# EAGLE design rc-driver-programmer (EAGLE 7.1.0)
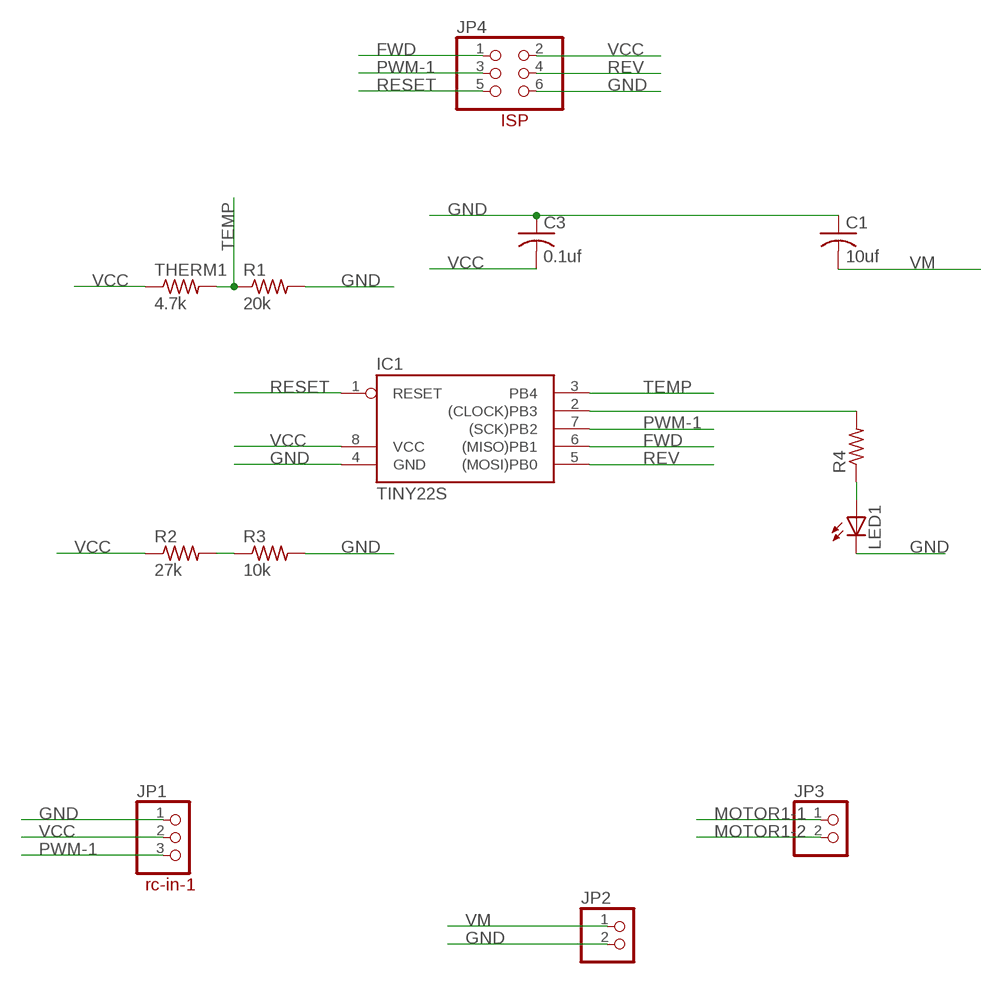
[diagram p0: schematic, sheet 1]

## Parts
C1  10uf  C-USC1210  [C1210]
C3  0.1uf  C-USC0805  [C0805]
IC1  TINY22S  [SOIC8]
JP1  PINHD-1X3  [1X03]
JP2  PINHD-1X2  [1X02]
JP3  PINHD-1X2  [1X02]
JP4  PINHD-2X3  [2X03]
LED1  LEDCHIP-LED0603  [CHIP-LED0603]
R1  20k  R-US_R0603  [R0603]
R2  27k  R-US_R0603  [R0603]
R3  10k  R-US_R0603  [R0603]
R4  R-US_R0603  [R0603]
THERM1  4.7k  R-US_R0603  [R0603]

## Nets
FWD: IC1.6((MISO)PB1) JP4.1
GND: C1.1 C3.1 IC1.4(GND) JP1.1 JP2.2 JP4.6 LED1.C R1.2 R3.2
MOTOR1-1: JP3.1
MOTOR1-2: JP3.2
N$2: IC1.2((CLOCK)PB3) R4.2
N$3: LED1.A R4.1
N$4: R2.2 R3.1
PWM-1: IC1.7((SCK)PB2) JP1.3 JP4.3
RESET: IC1.1(RESET) JP4.5
REV: IC1.5((MOSI)PB0) JP4.4
TEMP: IC1.3(PB4) R1.1 THERM1.2
VCC: C3.2 IC1.8(VCC) JP1.2 JP4.2 R2.1 THERM1.1
VM: C1.2 JP2.1

## Notes on the sheet
- ISP
- rc-in-1

## Library data of the parts
C1 C3 = resistor:C-US: CAPACITOR, American symbol
IC1 = mgregg:TINY22: MICROCONTROLLER 1K ROM 128 bytes RAM 128 bytes EEPROM; OC_FARNELL: unknown; OC_NEWARK: unknown
JP1 = pinhead:PINHD-1X3: PIN HEADER
JP2 JP3 = pinhead:PINHD-1X2: PIN HEADER
JP4 = pinhead:PINHD-2X3: PIN HEADER
LED1 = led:LED: LED OSRAM: - CHIPLED LG R971, LG N971, LY N971, LG Q971, LY Q971, LO R971, LY R971 LH N974, LH R974 LS Q976, LO Q976, LY Q976 LO Q996 - Hyper CHIPLED LW Q18S LB Q993, LB Q99A, LB R99A - SideLED LS A670, LO A670, LY A670, LG A670, LP A670 LB A673, LV A673, LT A673, LW A673 LH A674 LY A675 LS A676, LA A676, LO A676, LY A676, LW A676 LS A679, LY A679, LG A679 - Hyper Micro SIDELED® LS Y876, LA Y876, LO Y876, LY Y876 LT Y87S - SmartLED LW L88C, LW L88S LB L89C, LB L89S, LG L890 LS L89K, LO L89K, LY L89K LS L896, LA L896, LO L896, LY L896 - TOPLED LS T670, LO T670, LY T670, LG T670, LP T670 LSG T670, LSP T670, LSY T670, LOP T670, LYG T670 LG T671, LOG T671, LSG T671 LB T673, LV T673, LT T673, LW T673 LH T674 LS T676, LA T676, LO T676, LY T676, LB T676, LH T676, LSB T676, LW T676 LB T67C, LV T67C, LT T67C, LS T67K, LO T67K, LY T67K, LW E67C LS E67B, LA E67B, LO E67B, LY E67B, LB E67C, LV E67C, LT E67C LW T67C LS T679, LY T679, LG T679 LS T770, LO T770, LY T770, LG T770, LP T770 LB T773, LV T773, LT T773, LW T773 LH T774 LS E675, LA E675, LY E675, LS T675 LS T776, LA T776, LO T776, LY T776, LB T776 LHGB T686 LT T68C, LB T68C - Hyper Mini TOPLED® LB M676 - Mini TOPLED Santana® LG M470 LS M47K, LO M47K, LY M47K Source: http://www.osram.convergy.de LUXEON: - LUMILED® LXK2-PW12-R00, LXK2-PW12-S00, LXK2-PW14-U00, LXK2-PW14-V00 LXK2-PM12-R00, LXK2-PM12-S00, LXK2-PM14-U00 LXK2-PE12-Q00, LXK2-PE12-R00, LXK2-PE12-S00, LXK2-PE14-T00, LXK2-PE14-U00 LXK2-PB12-K00, LXK2-PB12-L00, LXK2-PB12-M00, LXK2-PB14-N00, LXK2-PB14-P00, LXK2-PB14-Q00 LXK2-PR12-L00, LXK2-PR12-M00, LXK2-PR14-Q00, LXK2-PR14-R00 LXK2-PD12-Q00, LXK2-PD12-R00, LXK2-PD12-S00 LXK2-PH12-R00, LXK2-PH12-S00 LXK2-PL12-P00, LXK2-PL12-Q00, LXK2-PL12-R00 Source: www.luxeon.com KINGBRIGHT: KA-3528ASYC Source: www.kingbright.com
R1-R4 THERM1 = resistor:R-US_: RESISTOR, American symbol

## Board
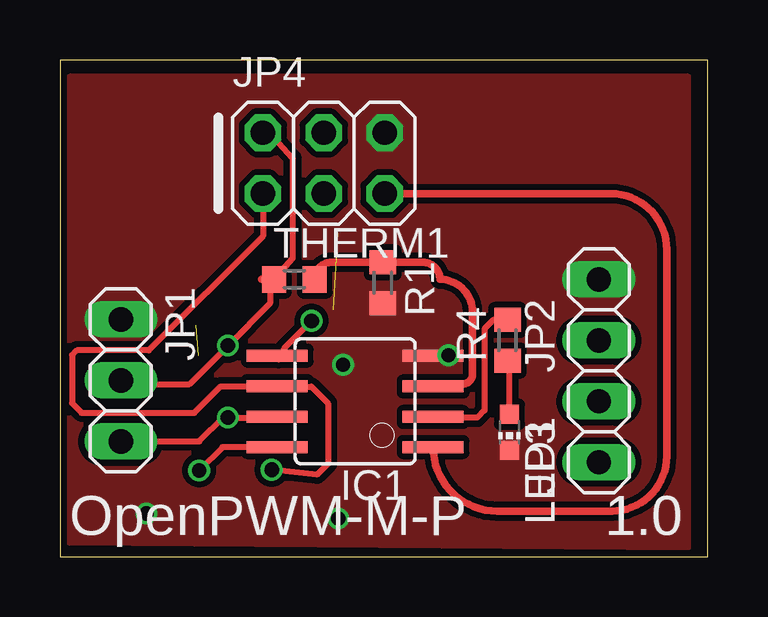
[diagram p1: board, top side]
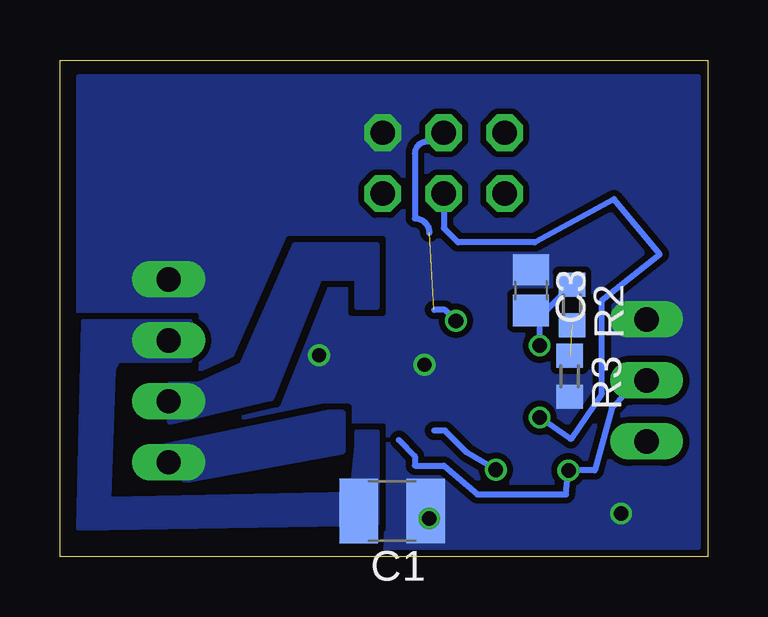
[diagram p2: board, bottom side, seen from below]

Size 27 x 20.7 mm. Coordinates in mm from the lower left corner, seen from the top.
Outline: 0,0 27,0 27,20.7 0,20.7 0,0
Copper layers (1*16): Top 0.035mm / dielectric 1.5mm / Bottom 0.035mm
Design rules "SeeedStudio_2layer_DRU_no_angle_20140221": minimum track width 6mil, minimum drill 12mil, track to track 6mil, track to pad 6mil, pad to pad 6mil, via to via 6mil, smd to smd 0mil, copper to edge 10mil, drill to drill 10mil, minimum pad ring 10mil, minimum via ring 6mil, stop-mask expansion 2mil, vias tented up to drill 100mil, thermal gap 10mil

### Footprints (pad centres in the part's own frame; a part is rotated, then mirrored left to right if it is on the bottom)
C1210 = smd 1.6 x 2.7: 1 -1.4,0; 2 1.4,0
C0805 = smd 1.3 x 1.5: 1 -0.85,0; 2 0.85,0
SOIC8 = smd 0.5 x 2.54: 1 -1.905,-3.251; 2 -0.645,-3.251; 3 0.625,-3.251; 4 1.895,-3.251; 5 1.905,3.251; 6 0.635,3.251; 7 -0.635,3.251; 8 -1.905,3.251
1X03 = drill 1.016 long: 1 -2.54,0; 2 0,0; 3 2.54,0
1X02 = drill 1.016 long: 1 -1.27,0; 2 1.27,0
2X03 = drill 1.016 octagon: 1 -2.54,-1.27; 2 -2.54,1.27; 3 0,-1.27; 4 0,1.27; 5 2.54,-1.27; 6 2.54,1.27
CHIP-LED0603 = smd 0.8 x 0.8: A 0,-0.75; C 0,0.75
R0603 = smd 1 x 1.1: 1 -0.85,0; 2 0.85,0

### Placement (x,y rotation side)
C1  13.15,1.91 180 bottom
C3  7.36,11.11 270 bottom
IC1  12.31,6.48 90 top
JP1  2.54,7.35 270 top
JP2  22.47,10.29 90 top
JP3  22.47,5.21 90 top
JP4  11,16.4 0 top
LED1  18.74,5.19 180 top
R1  13.46,11.42 270 top
R2  5.65,10.49 270 bottom
R3  5.75,7.52 270 bottom
R4  18.66,9.02 90 top
THERM1  9.77,11.56 0 top

### Tracks (layer width: path | path; a pad name or v marks a point on that pad's centre or on a via)
FWD  (via drill 0.61)
  Top 0.254: v8.83,3.63 10.72,3.43 11.17,3.89 11.17,6.4 10.49,7.09 9.6,7.09 | 9.6,7.09 9.12,7.09 IC1.6 | JP4.1 8.46,13.36 3.7,8.6 0.7,8.6 0.5,8.4 0.5,6.4 0.9,6 5.6,6 6.7,7.1 9.59,7.1 9.6,7.09
  Bottom 0.254: 11.4,5.26 10.95,5.26 10.03,4.34 v8.83,3.63
GND  (via drill 0.6)
  other vias: 16.2,8.4 3.6,1.8 11.6,1.6 11.8,8
  pour Top (isolate 0.254, rank 6, no thermals): 26.2,20 0.4,20 0.4,0.6 26.2,0.4
  pour Bottom (isolate 0.254, rank 6, no thermals): 26.2,0.4 26.2,20 0.4,20 0.4,0.4
MOTOR1-1
  pour Bottom (no thermals): 21.8,3.2 15.2,4.4 15.2,6 15.8,6 22.6,4.6
MOTOR1-2
  pour Bottom (no thermals): 14.6,10.4 14.6,11.6 16.2,11.6 18.2,6.6 22.4,5.6 22.4,7.2 21.2,7.2 19.4,8 17.2,13 13.8,13 13.8,10.4
N$2
  Top 0.254: R4.2 18.07,9.87 17.7,9.5 17.7,6.1 17.4,5.8 15.6,5.8 IC1.2
N$3
  Top 0.254: LED1.A 18.74,8.09 R4.1
N$4  (1 unrouted)
PWM-1  (via drill 0.6)
  Top 0.254: JP1.3 5.81,4.81 6.8,5.8 v7,5.8 9.01,5.8 IC1.7
  Bottom 0.254: JP4.3 11,13.7 10.4,13.1 7.2,13.1 3.9,14.9 2,12.6 4.4,10.7 4.4,6.8 5.7,4.9 v7,5.8
RESET
  Top 0.305: IC1.1 arc90 18.24,1.9 23,1.9 arc90 25.3,4.2 25.3,12.8 arc90 22.97,15.13 JP4.5
REV  (via drill 0.61)  (1 unrouted)
  Top 0.254: v10.49,9.83 9.35,8.69 9.35,8.46 9.12,8.23 IC1.5
  Bottom 0.254: 11.4,10.29 10.95,10.29 v10.49,9.83 | JP4.4 arc90 11.37,17.3 11.7,17.3 arc-90 12.2,16.8 12.2,14.1 arc90 11.6,13.5
TEMP
  Top 0.305: IC1.3 arc-90 15.66,7.2 16.8,7.2 arc90 17.2,7.6 17.2,10.2 arc90 15.84,11.56 arc90 15.13,12.27 R1.1 11.33,12.27 arc90 THERM1.2
VCC  (via drill 0.6)
  Top 0.254: JP1.2 2.69,7.2 5.4,7.2 v7,8.8 8.76,10.56 8.76,11.4 | IC1.8 6.78,4.58 v5.8,3.6 | JP4.2 8.73,17.67 9.7,16.6 9.7,12.44 THERM1.1
  Top 0.305: THERM1.1 8.4,11.56
  Top 0.406: 8.76,11.4 THERM1.1
  Bottom 0.254: 12.87,4.87 12.2,4.2 12.2,3.8 11,3.8 9.6,2.6 5.9,2.6 v5.8,3.6 4.7,3.6 4,6.2 3.4,6.8 3.4,7.2 2.69,7.2 JP1.2 | R2.1 6.73,10.26 C3.2 7,9.9 v7,8.8
VM
  pour Bottom (no thermals): 21.6,8.2 24.6,8.2 24.8,7.8 25,2.4 14.8,2.6 14.6,4.6 14.6,5.2 13.8,5.2 13.8,1.4 26.2,1.2 26,9.8 21.6,9.8

### Text on the board
tPlace: OpenPWM-M-P | 1.0